# Altium schematic sheet InterfacePagamentos.SchDoc: CONTROLADORA AIRPOPCORN
size A3; DocumentNumber: 10.00.0025; SheetNumber: 11; SheetTotal: 16
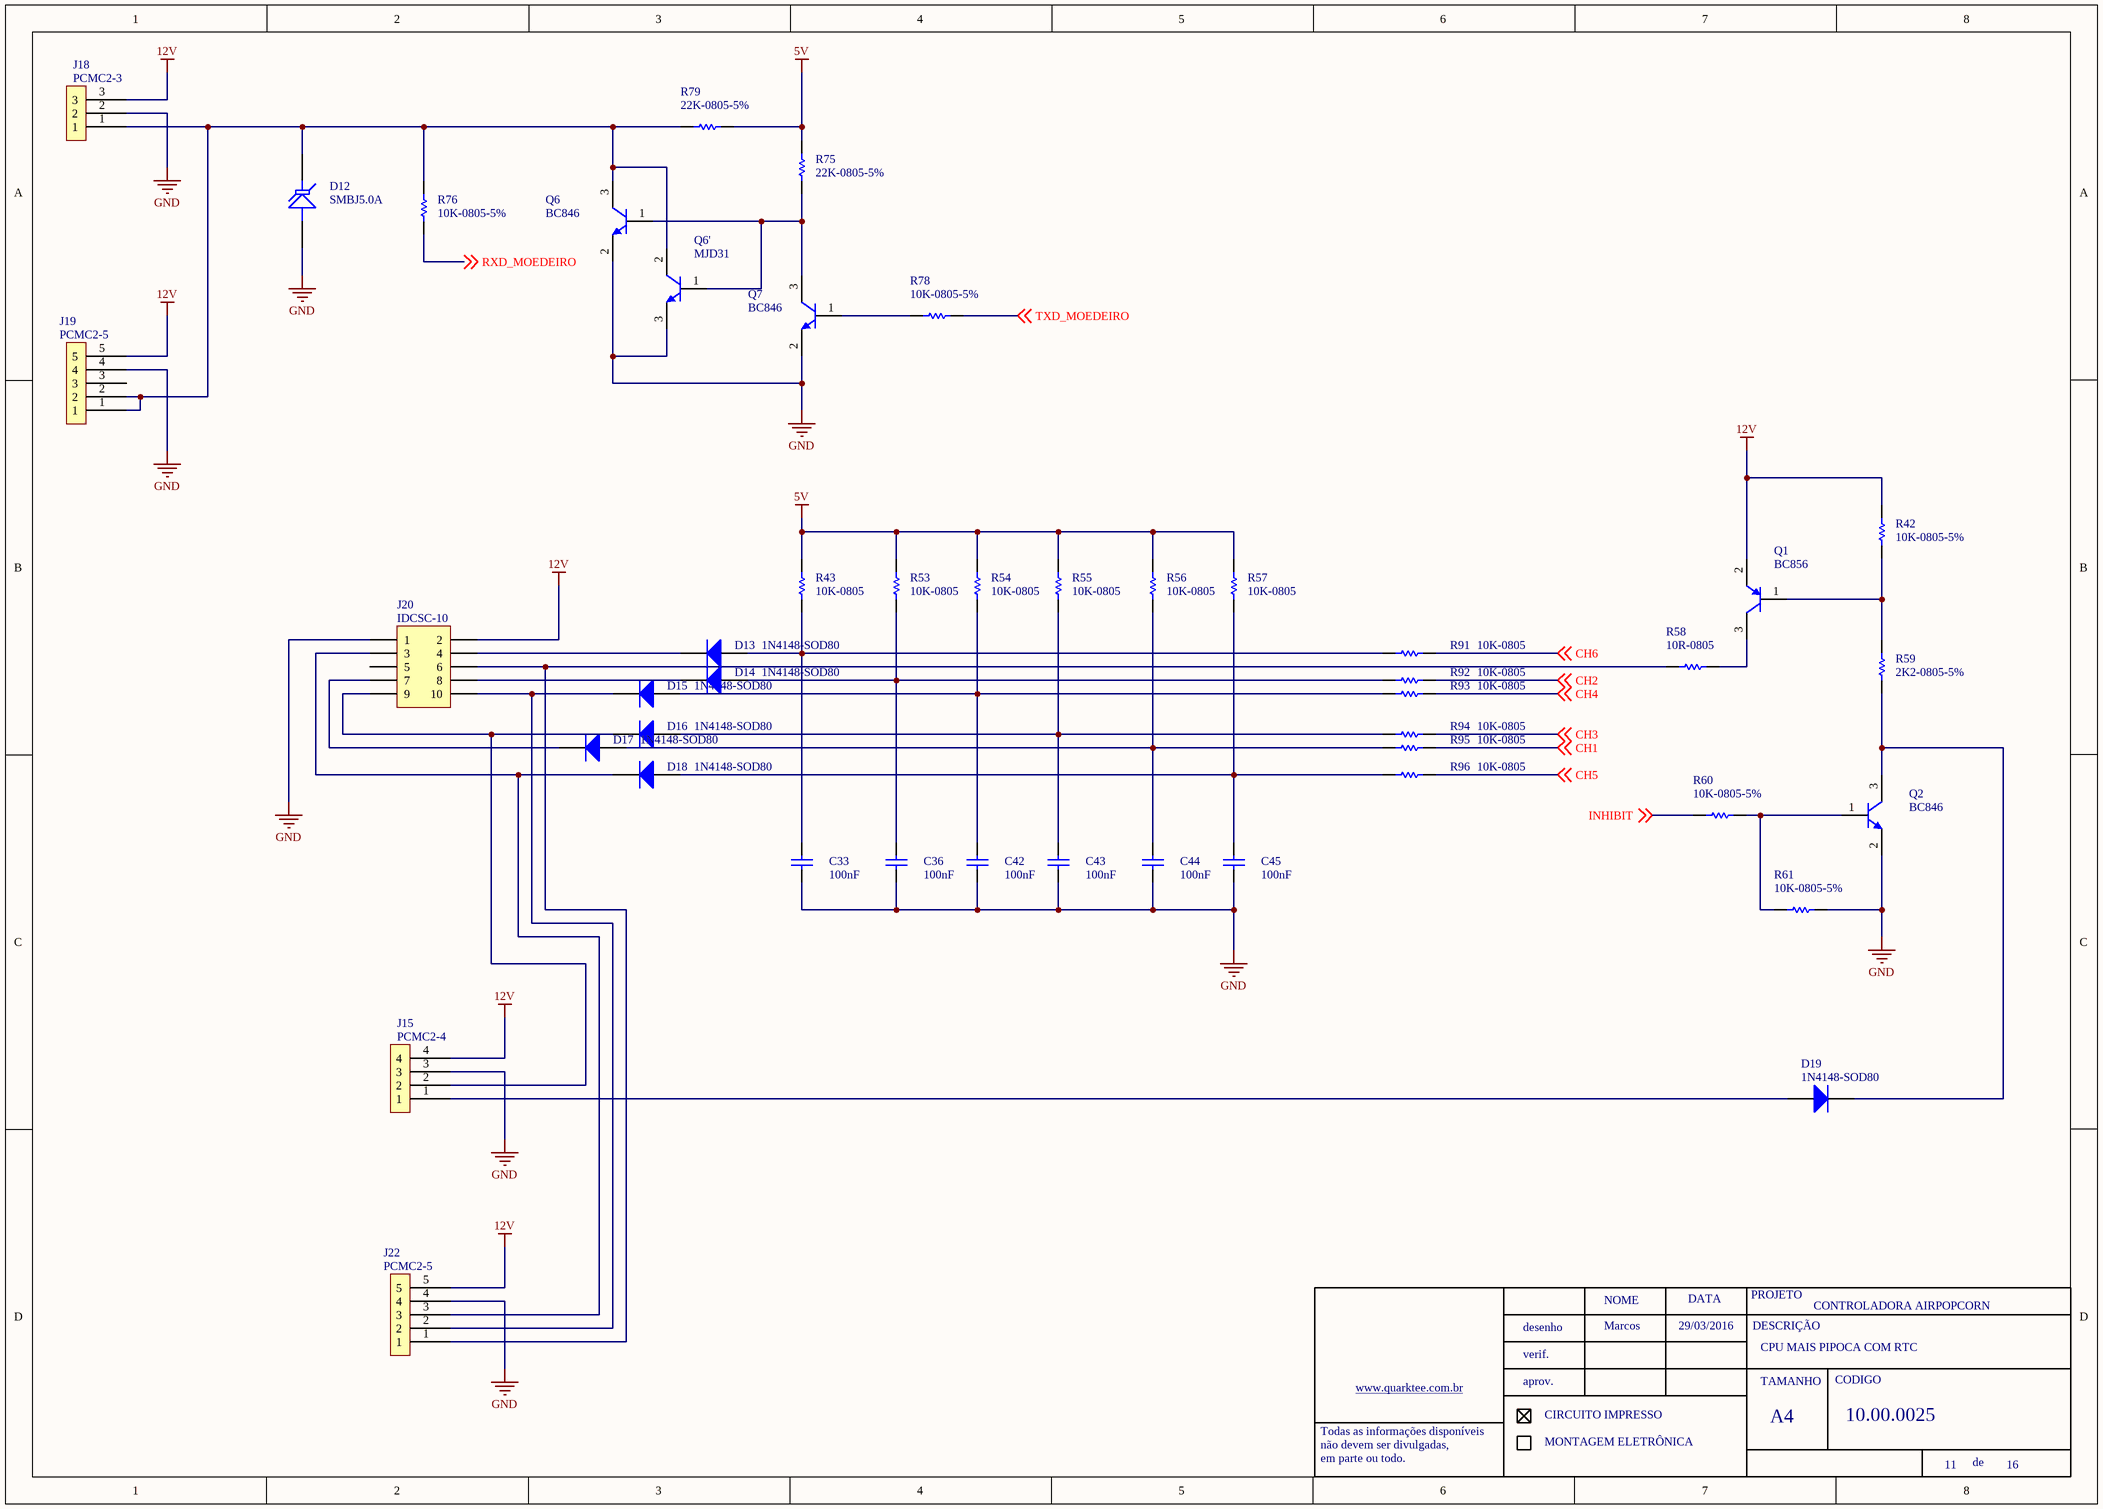
[diagram p0: InterfacePagamentos.SchDoc]

## Parts
C33  100nF  [0805-REVISADO O]
C36  100nF  [0805-REVISADO O]
C42  100nF  [0805-REVISADO O]
C43  100nF  [0805-REVISADO O]
C44  100nF  [0805-REVISADO O]
C45  100nF  [0805-REVISADO O]
D12  SMBJ5.0A  [SMB/DO-214AA]
D13  1N4148-SOD80  [MINIMLEF/SOD80]
D14  1N4148-SOD80  [MINIMLEF/SOD80]
D15  1N4148-SOD80  [MINIMLEF/SOD80]
D16  1N4148-SOD80  [MINIMLEF/SOD80]
D17  1N4148-SOD80  [MINIMLEF/SOD80]
D18  1N4148-SOD80  [MINIMLEF/SOD80]
D19  1N4148-SOD80  [MINIMLEF/SOD80]
J15  PCMC2-4  [PCMC2-4]
J18  PCMC2-3  [PCMC2-3]
J19  PCMC2-5  [PCMC2-5]
J20  IDCSC-10  [IDCSC-10]
J22  PCMC2-5  [PCMC2-5]
Q1  BC856  [SOT23 - REVISAD]
Q2  BC846  [SOT23 - REVISAD]
Q6  BC846  [SOT23 - REVISAD]
Q6'  MJD31  [DPAK REVISADO O]
Q7  BC846  [SOT23 - REVISAD]
R42  10K-0805-5%  [0805-REVISADO O]
R43  10K-0805  [0805-REVISADO O]
R53  10K-0805  [0805-REVISADO O]
R54  10K-0805  [0805-REVISADO O]
R55  10K-0805  [0805-REVISADO O]
R56  10K-0805  [0805-REVISADO O]
R57  10K-0805  [0805-REVISADO O]
R58  10R-0805  [1206-REVISADO O]
R59  2K2-0805-5%  [0805-REVISADO O]
R60  10K-0805-5%  [0805-REVISADO O]
R61  10K-0805-5%  [0805-REVISADO O]
R75  22K-0805-5%  [0805-REVISADO O]
R76  10K-0805-5%  [0805-REVISADO O]
R78  10K-0805-5%  [0805-REVISADO O]
R79  22K-0805-5%  [0805-REVISADO O]
R91  10K-0805  [0805-REVISADO O]
R92  10K-0805  [0805-REVISADO O]
R93  10K-0805  [0805-REVISADO O]
R94  10K-0805  [0805-REVISADO O]
R95  10K-0805  [0805-REVISADO O]
R96  10K-0805  [0805-REVISADO O]

## Nets
5V: R43.2 R53.2 R54.2 R55.2 R56.2 R57.2 R75.2 R79.2
12V: J15.4 J18.3 J19.5 J20.2 J22.5 Q1.2(E) R42.2
GND: C33.1 C36.1 C42.1 C43.1 C44.1 C45.1 D12.1(A) J15.3 J18.2 J19.4 J20.1 J22.4 Q2.2(E) Q6.2(E) Q6'.3(E) Q7.2(E) R61.2
CH1: R95.1 ; off-sheet CH1
CH2: R92.1 ; off-sheet CH2
CH3: R94.1 ; off-sheet CH3
CH4: R93.1 ; off-sheet CH4
CH5: R96.1 ; off-sheet CH5
CH6: R91.1 ; off-sheet CH6
INHIBIT: R60.1 ; off-sheet INHIBIT
RXD_MOEDEIRO: R76.2 ; off-sheet RXD_MOEDEIRO
TXD_MOEDEIRO: R78.2 ; off-sheet TXD_MOEDEIRO
NetC33_2: C33.2 D13.1 R43.1 R91.2
NetC36_2: C36.2 D14.1 R53.1 R92.2
NetC42_2: C42.2 D15.1 R54.1 R93.2
NetC43_2: C43.2 D16.1 R55.1 R94.2
NetC44_2: C44.2 D17.1 R56.1 R95.2
NetC45_2: C45.2 D18.1 R57.1 R96.2
NetD12_2: D12.2(K) J18.1 J19.1 J19.2 Q6.3(C) Q6'.2(C) R76.1 R79.1
NetD13_2: D13.2 J20.4
NetD14_2: D14.2 J20.8
NetD15_2: D15.2 J20.10 J22.2
NetD16_2: D16.2 J15.2 J20.9
NetD17_2: D17.2 J20.7
NetD18_2: D18.2 J20.3 J22.3
NetD19_1: D19.1 J15.1
NetD19_2: D19.2 Q2.3(C) R59.1
NetJ20_6: J20.6 J22.1 R58.2
NetQ1_1: Q1.1(B) R42.1 R59.2
NetQ1_3: Q1.3(C) R58.1
NetQ2_1: Q2.1(B) R60.2 R61.1
NetQ6_1: Q6.1(B) Q6'.1(B) Q7.3(C) R75.1
NetQ7_1: Q7.1(B) R78.1

Not connected (* = marked no-connect by the designer): J19 3; J20 5

## Notes on the sheet
- Marcos
- 29/03/2016
- CPU MAIS PIPOCA COM RTC
- NOME
- DATA
- PROJETO
- DESCRIÇÃO
- www.quarktee.com.br
- desenho
- verif.
- aprov.
- TAMANHO
- CODIGO
- Todas as informações disponíveis
- não devem ser divulgadas,
- em parte ou todo.
- CIRCUITO IMPRESSO
- MONTAGEM ELETRÔNICA
- A4
- de

## Library data of the parts
C33 C36 C42-C45 = 100nF/50-0805-NPO: ERP: 104.11.005
J20 = IDCSN: CONECTOR HEADER 10 VIAS 90º; ERP: 435.00.009
Q1 = BC856L: ERP: 106.22.002
Q2 Q6 Q7 = BC846: BC846L; ERP: 106.22.001
R43 R53-R57 R59 R91-R96 = 4K7-1206-5%: ERP: 102.12.050
R58 = 10K-0805-5%: ERP: 102.11.054
R76 = 56K-0805-5%: ERP: 102.11.063
D12 = SMBJ5.0A: ERP: 128.02.002
D13-D19 = 1N4148-SOD80: ERP: 120.19.001
R42 R60 R61 R78 = 10K-0805-5%: ERP: 102.11.054
R75 R79 = 22K-0805-5%: ERP: 102.11.058